# Altium schematic sheet Primary.SchDoc
size B; SheetNumber: 1; SheetTotal: 1
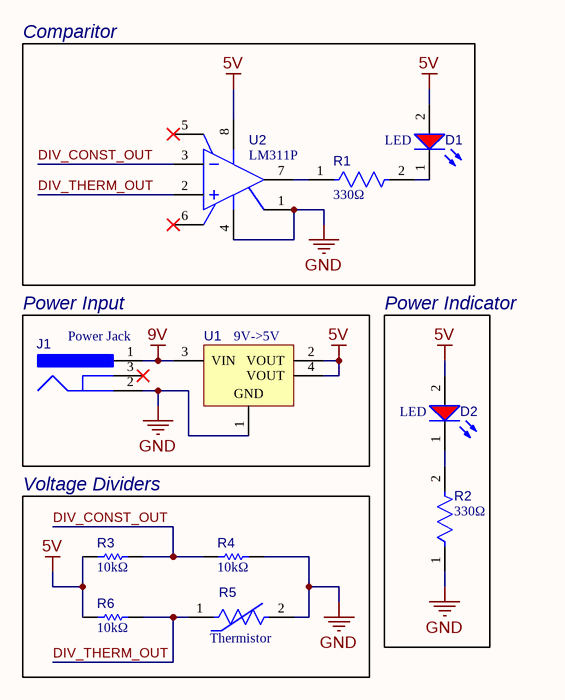
[diagram p0: Primary.SchDoc]

## Parts
D1  LED  [WL-SMCW_1206_150120xx75000]
D2  LED  [WL-SMCW_1206_150120xx75000]
J1  Power Jack  [CUI-PJ-002A_V]
R1  330Ω  [FP-CRCW1206-e3-IPC_A]
R2  330Ω  [FP-CRCW1206-e3-IPC_A]
R3  10kΩ  [RESC3116X65X40ML10T20]
R4  10kΩ  [RESC3116X65X40ML10T20]
R5  Thermistor  [FP-NCP18-0_15-IPC_A]
R6  10kΩ  [RESC3116X65X40ML10T20]
U1  9V->5V  [SOT-223_L]
U2  LM311P  [FP-P0008A-MFG]

## Blocks framed on the sheet
Comparitor: D1 R1 U2
Power Input: J1 U1
Power Indicator: D2 R2
Voltage Dividers: R3-R6

## Nets
5V: D1.2(A) D2.2(A) R3.1 R6.1 U1.2(VOUT) U1.4(VOUT) U2.8(VCC+)
9V: J1.1 U1.3(VIN)
GND: J1.2 R2.1 R4.2 R5.2 U1.1(GND) U2.1(EMIT_OUT) U2.4(VCC-)
DIV_CONST_OUT: R3.2 R4.1 U2.3(IN-)
DIV_THERM_OUT: R5.1 R6.2 U2.2(IN+)
NetD1_1: D1.1(K) R1.2
NetD2_1: D2.1(K) R2.2
NetR1_1: R1.1 U2.7(COL_OUT)

Not connected (* = marked no-connect by the designer): J1 3*; U2 5(BALANCE)* 6(BAL/STRB)*

## Library data of the parts
D1 D2 = CMP-1426-00013-4: WL-SMCW SMT Mono-Color Chip LED Waterclear; Luminous Intensity: 150mcd; Max Junction Temperature (Tj): 95°C; Lens Style: Clear, Rectangular; Color: Red; Wavelength: 625nm; Forward Current: 100mA; Test Current: 20mA; Power Dissipation: 72mW; Forward Voltage: 2V; Peak Wavelength: 630nm; Reverse Voltage: 5V; Viewing Angle: 140°; Length: 3.2mm; Case Code (Imperial): 1206; Mount: Surface Mount; Case/Package: 1206; Packaging: Tape and Reel; REACH SVHC: Unknown; Max Operating Temperature: 85°C; RoHS: Compliant; Height: 680µm; Dominant Wavelength: 625nm; Width: 1.6mm; Max Reverse Voltage (DC): 5V; Case Code (Metric): 3216; Min Operating Temperature: -40°C
J1 = CMP-2000-06895-2: Through Hole Right Angle DC Power Jack, 2.5 A, 2 mm Center Pin, 3 Position, -25 to 85 degC, RoHS, Bulk; Manufacturer: CUIInc.; Brand: CUI; Inside Contact Diameter: 2mm; Voltage Rating: 24V; Outside Contact Diameter: 6.5mm; Current Rating: 2.5A; Insulation Resistance: 50MOhms; Contact Gender: Male; Connector Type: DCPowerJack; Datasheet Version: Rev. 1.03, 04/2016; Housing Material: PolybutyleneTerephthalate(PBT); Operating Temperature Range: -25Cto+85C; Termination Style: ThroughHole; Product Category: DCPowerConnectors; Mounting Technology: ThroughHole; Mounting Style: ThroughHole; Factory Pack Quantity: 500; Contact Plating: Nickel; Package Reference: PJ-002A; Mounting Angle: Right; Package Description: 3-Pin Through Hole Device, Body 14.4 x 9 mm, Height 11 mm; Flammability Rating: UL94V-0; Manufacturer URL: http://www.cui.com/; Product: Jacks; Contact Material: Copper; Datasheet URL: http://www.cui.com/product/resource/pj-002a.pdf; RoHS: True
R1 R2 = CMP-2003-02098-2: RES Thick Film, 330Ω, 1%, 0.25W, 100ppm/°C, 1206; Voltage Rating: 200V; Resistance: 330R; Max Power Dissipation: 250mW; Height: 0.55mm; Mount: Surface Mount; Min Operating Temperature: -55°C; Depth: 1.6mm; Features: Automotive AEC-Q200; Voltage Rating (DC): 200V; Military Standard: Not; Packaging: Tape and Reel; Composition: Thick Film; Contact Plating: Tin; Case Code (Imperial): 1206; Case/Package: 1206; Number of Terminations: 2; Length: 3.2mm; Lead Free: Lead Free; Tolerance: 1%; Temperature Coefficient: 100ppm/°C; Case Code (Metric): 3216; Width: 1.6mm; Weight: 0.000353oz; Termination: SMD/SMT; Radiation Hardening: No; Package Quantity: 10; Power Rating: 250mW; Max Operating Temperature: 155°C
R3 R4 R6 = CMP-1014-00623-2: Chip Resistor, 10 KOhm, +/- 1%, 0.25 W, -55 to 155 degC, 1206 (3216 Metric), RoHS, Tape and Reel; Manufacturer: Yageo; Voltage Rating: 200V; Resistance: 10KOhm; Temperature Coefficient: 100ppm/degreesC; Power Rating: 250mW; Packaging: TapeandReel; Termination: SMD/SMT; REACH SVHC: Unknown; Tolerance: 1%; Height: 0.55mm; Composition: ThickFilm; Max Operating Temperature: 155degC; Datasheet Version: Rev. 5, 10/2016; Lead Free: LeadFree; Case Code (Metric): 3216; Depth: 1.6mm; Package Quantity: 5000; RoHSCompliant: true; Military Standard: Not; Case/Package: 1206; Case Code (Imperial): 1206; Min Operating Temperature: -55degC; Datasheet URL: http://www.yageo.com/NewPortal/yageodocoutput?fileName=/pdf/R-Chip/PYu-RC_Group_51_RoHS_L_5.pdf; Length: 3.1mm; Manufacturer URL: http://www.yageo.com/; Package Reference: 1206.0; Width: 1.6mm; Package Description: 2-Pin Surface Mount Device, Body 3.1 x 1.6 mm
R5 = CMP-2000-05271-3: NTC Thermistor for Temperature Sensor, 0603, 10kΩ, 1%, 0.1mA, 5V; Manufacturer Series: NCP18; Accuracy: 0.7%; Current Rating: 310uA; Max Power Dissipation: 100mW; Thermistor Application: TEMPERATURE COMPENSATION; Number of Terminals/Pins: 2; Resistance: 10kR; Case Code (Metric): 1608; RoHS Compliant: Yes; Max Operating Temperature: 125°C; Resistance Tolerance: 1%; Case/Package: 0603; Mount: Surface Mount; Lead Free: Lead Free; Min Operating Temperature: -40°C; REACH SVHC: No SVHC; Package Shape: Rectangular; Radiation Hardening: No; Series: NCP; Depth: 0.8mm; Number of Pins: 2; Length: 1.6mm; Height: 0.8mm; Terminal Placement: Dual; Tolerance: 1%; Case Code (Imperial): 0603; Terminal Finish: Tin; Power Rating: 100mW; Termination: SMD/SMT; Packaging: Tape and Reel; Package Quantity: 1
U1 = CMP-0244-00312-1: Fixed Low Drop Positive Voltage Regulator, 5V, 4-Pin SOT-223, Tape and Reel; ComponentLink1URL: http://www.st.com; DatasheetVersion: 1/11/2011; PackageDescription: 4-Pin SOT-223 Package, 6.5 x 3.5 mm Body, 2.3 mm Pitch, 7 mm Lead Span; ComponentLink2URL: http://www.st.com/internet/com/TECHNICAL_RESOURCES/TECHNICAL_LITERATURE/DATASHEET/CD00000544.pdf; ComponentLink1Description: Manufacturer URL; PackageReference: SOT-223; PackageVersion: 2010; ComponentLink2Description: Datasheet
U2 = CMP-1685-00016-2: Manufacturer Lifecycle Status: ACTIVE; NexarPartId: 24336; Output Type: TTL; Max Output Voltage: 7.5mV; Min Supply Voltage: 3.5V; Min Dual Supply Voltage: 1.75V; Max Supply Current: 7.5mA; Number of Elements: 1; Response Time: 165ns; Max Dual Supply Voltage: 15V; Max Supply Voltage: 30V; Max Junction Temperature (Tj): 150°C; Max Power Dissipation: 500mW; Input Offset Voltage (Vos): 2mV; Resistance: 390Ω; Operating Supply Voltage: 28V; Power Rating: 100mW; Dual Supply Voltage: 9V; Output Current per Channel: 50mA; Turn-On Delay Time: 115ns; Tolerance: 1%; Voltage Gain: 106.02dB; Input Bias Current: 250nA; Voltage Rating: 75V; Contact Plating: Gold; Case Code (Imperial): 0603; Number of Circuits: 1; Lifecycle Status: Production; Ambient Temperature Range High: 70°C; Radiation Hardening: No; Quiescent Current: 7.5mA; Number of Channels: 1; Max Operating Temperature: 70°C; Height: 5.08mm; Type: General Purpose; Case Code (Metric): 1608; Mount: Surface Mount, Through Hole; Case/Package: PDIP; Thickness: 3.9mm; REACH SVHC: No SVHC; Length: 9.81mm; RoHS: Compliant; Schedule B: 8542390000, 8542390000; Lead Free: Lead Free; Min Operating Temperature: 0°C; Width: 6.35mm; Output Current: 50mA; Packaging: Tape and Reel; Nominal Supply Current: 7.5mA; Weight: 2.012816mg; Propagation Delay: 115ns; Max Input Current: 250nA; Number of Pins: 8